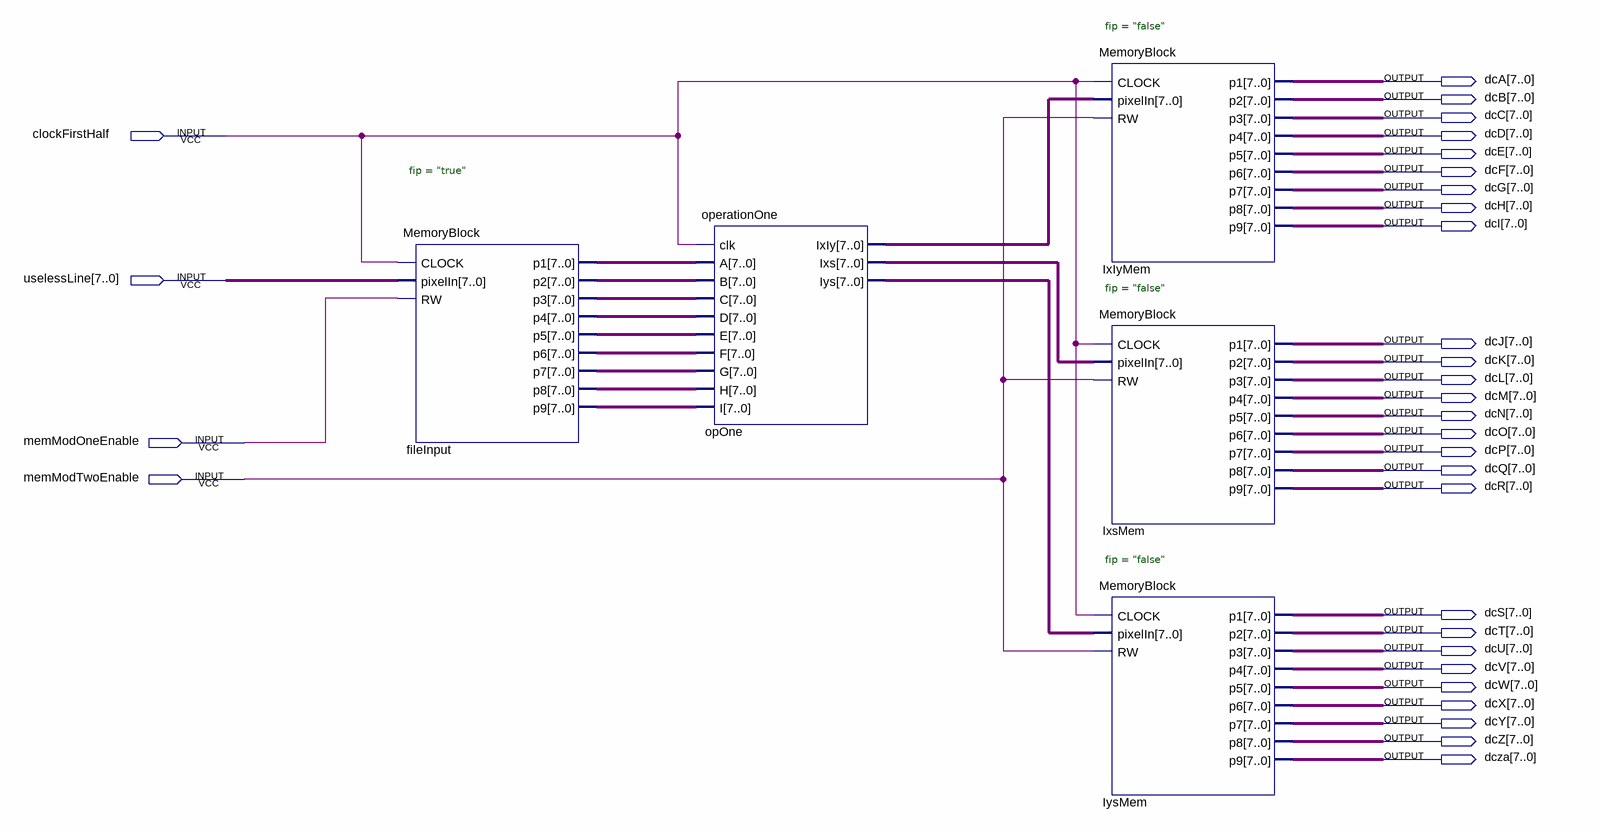
[diagram p0: schematic sheet]
// Quartus schematic firsHalf.bdf as structural Verilog: 5 symbols, 31 pins
module firsHalf (
  input  clockFirstHalf,
  input  [7:0] uselessLine,
  input  memModOneEnable,
  input  memModTwoEnable,
  output [7:0] dcA,
  output [7:0] dcB,
  output [7:0] dcC,
  output [7:0] dcD,
  output [7:0] dcE,
  output [7:0] dcF,
  output [7:0] dcG,
  output [7:0] dcH,
  output [7:0] dcI,
  output [7:0] dcJ,
  output [7:0] dcK,
  output [7:0] dcL,
  output [7:0] dcM,
  output [7:0] dcN,
  output [7:0] dcO,
  output [7:0] dcP,
  output [7:0] dcQ,
  output [7:0] dcR,
  output [7:0] dcS,
  output [7:0] dcT,
  output [7:0] dcU,
  output [7:0] dcV,
  output [7:0] dcW,
  output [7:0] dcX,
  output [7:0] dcY,
  output [7:0] dcZ,
  output [7:0] dcza
);

  wire [7:0] fileInput_p1, fileInput_p2, fileInput_p3, fileInput_p4, fileInput_p5, fileInput_p6,
       fileInput_p7, fileInput_p8, fileInput_p9, opOne_ixiy, opOne_ixs, opOne_iys;

  MemoryBlock #(.fip("true")) fileInput (
    .CLOCK(clockFirstHalf), .pixelIn(uselessLine), .RW(memModOneEnable), .p1(fileInput_p1),
    .p2(fileInput_p2), .p3(fileInput_p3), .p4(fileInput_p4), .p5(fileInput_p5), .p6(fileInput_p6),
    .p7(fileInput_p7), .p8(fileInput_p8), .p9(fileInput_p9));
  operationOne opOne (
    .clk(clockFirstHalf), .A(fileInput_p1), .B(fileInput_p2), .C(fileInput_p3), .D(fileInput_p4),
    .E(fileInput_p5), .F(fileInput_p6), .G(fileInput_p7), .H(fileInput_p8), .I(fileInput_p9),
    .IxIy(opOne_ixiy), .Ixs(opOne_ixs), .Iys(opOne_iys));
  MemoryBlock #(.fip("false")) IxIyMem (
    .CLOCK(clockFirstHalf), .pixelIn(opOne_ixiy), .RW(memModTwoEnable), .p1(dcA), .p2(dcB), .p3(dcC),
    .p4(dcD), .p5(dcE), .p6(dcF), .p7(dcG), .p8(dcH), .p9(dcI));
  MemoryBlock #(.fip("false")) IxsMem (
    .CLOCK(clockFirstHalf), .pixelIn(opOne_ixs), .RW(memModTwoEnable), .p1(dcJ), .p2(dcK), .p3(dcL),
    .p4(dcM), .p5(dcN), .p6(dcO), .p7(dcP), .p8(dcQ), .p9(dcR));
  MemoryBlock #(.fip("false")) IysMem (
    .CLOCK(clockFirstHalf), .pixelIn(opOne_iys), .RW(memModTwoEnable), .p1(dcS), .p2(dcT), .p3(dcU),
    .p4(dcV), .p5(dcW), .p6(dcX), .p7(dcY), .p8(dcZ), .p9(dcza));
endmodule
